# EAGLE design kurodako (EAGLE 7.5.0)
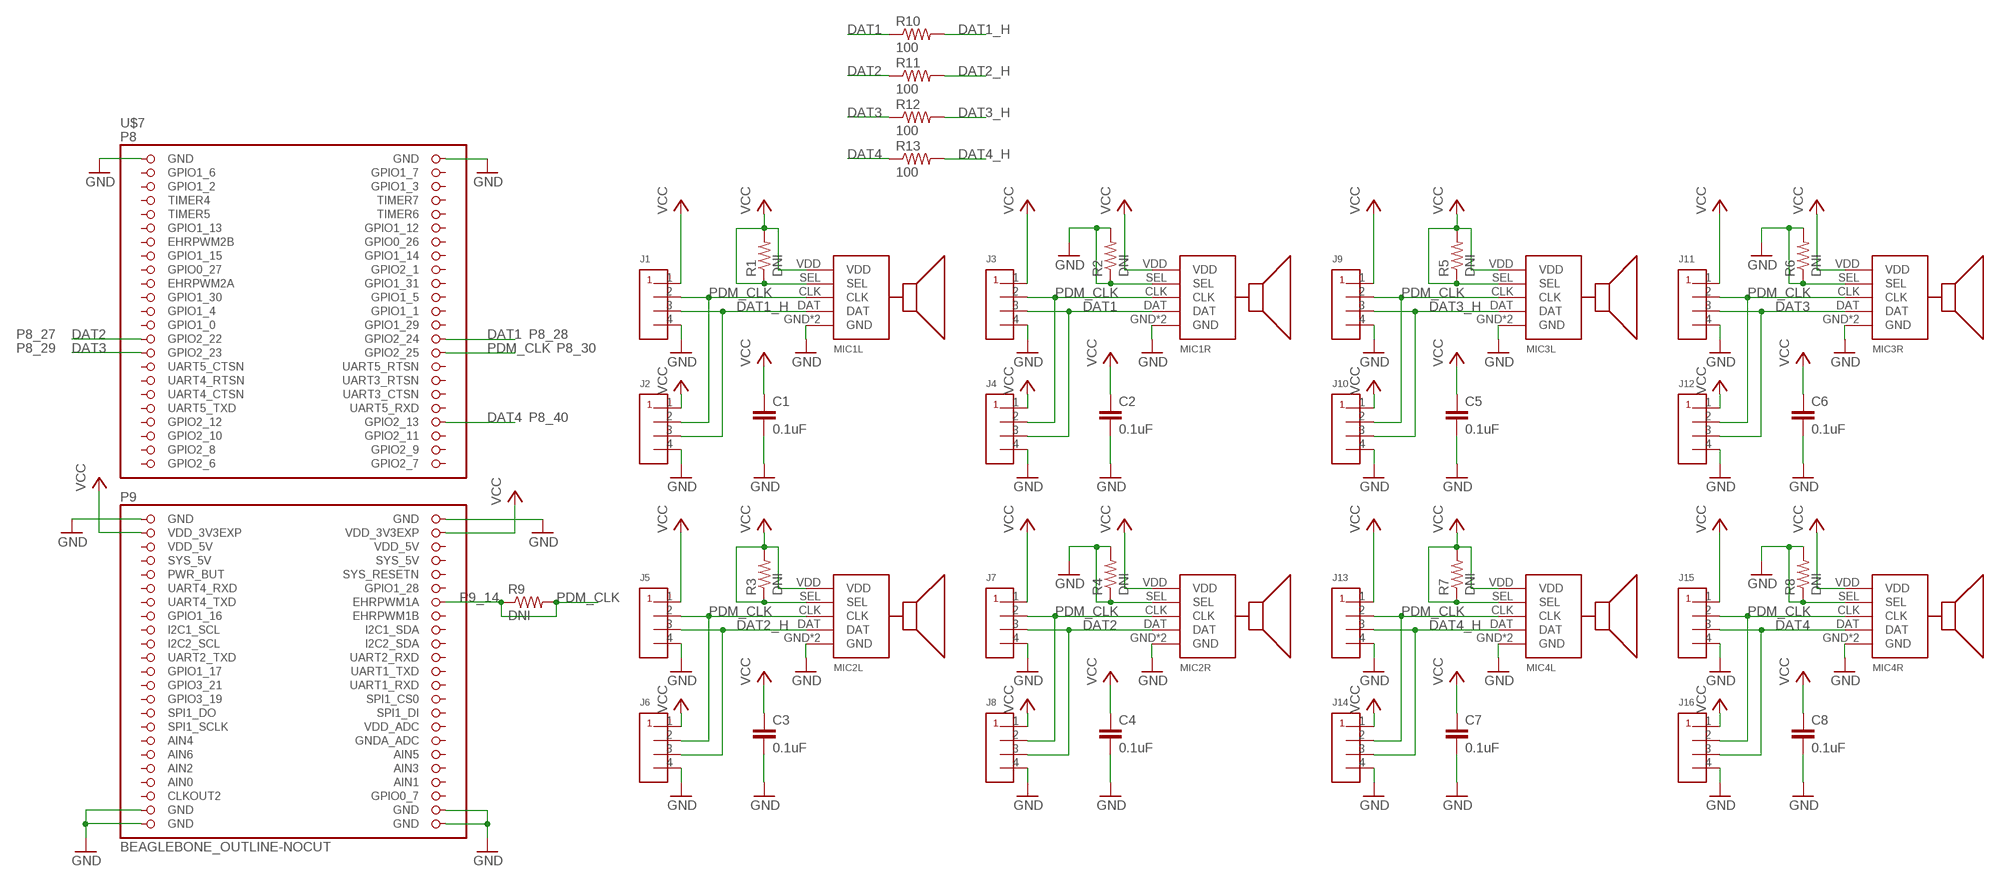
[diagram p0: schematic, sheet 1]

## Parts
C1  0.1uF  CAP0805  [0805]
C2  0.1uF  CAP0805  [0805]
C3  0.1uF  CAP0805  [0805]
C4  0.1uF  CAP0805  [0805]
C5  0.1uF  CAP0805  [0805]
C6  0.1uF  CAP0805  [0805]
C7  0.1uF  CAP0805  [0805]
C8  0.1uF  CAP0805  [0805]
J1  CONN-4P-MICROMATCH-SMD  [MICROMATCH-4P-SMD]
J2  CONN-4P-MICROMATCH-SMD  [MICROMATCH-4P-SMD]
J3  CONN-4P-MICROMATCH-SMD  [MICROMATCH-4P-SMD]
J4  CONN-4P-MICROMATCH-SMD  [MICROMATCH-4P-SMD]
J5  CONN-4P-MICROMATCH-SMD  [MICROMATCH-4P-SMD]
J6  CONN-4P-MICROMATCH-SMD  [MICROMATCH-4P-SMD]
J7  CONN-4P-MICROMATCH-SMD  [MICROMATCH-4P-SMD]
J8  CONN-4P-MICROMATCH-SMD  [MICROMATCH-4P-SMD]
J9  CONN-4P-MICROMATCH-SMD  [MICROMATCH-4P-SMD]
J10  CONN-4P-MICROMATCH-SMD  [MICROMATCH-4P-SMD]
J11  CONN-4P-MICROMATCH-SMD  [MICROMATCH-4P-SMD]
J12  CONN-4P-MICROMATCH-SMD  [MICROMATCH-4P-SMD]
J13  CONN-4P-MICROMATCH-SMD  [MICROMATCH-4P-SMD]
J14  CONN-4P-MICROMATCH-SMD  [MICROMATCH-4P-SMD]
J15  CONN-4P-MICROMATCH-SMD  [MICROMATCH-4P-SMD]
J16  CONN-4P-MICROMATCH-SMD  [MICROMATCH-4P-SMD]
MIC1L  SPM1437HM4H-B  [MEMS-MIC-6PAD]
MIC1R  SPM1437HM4H-B  [MEMS-MIC-6PAD]
MIC2L  SPM1437HM4H-B  [MEMS-MIC-6PAD]
MIC2R  SPM1437HM4H-B  [MEMS-MIC-6PAD]
MIC3L  SPM1437HM4H-B  [MEMS-MIC-6PAD]
MIC3R  SPM1437HM4H-B  [MEMS-MIC-6PAD]
MIC4L  SPM1437HM4H-B  [MEMS-MIC-6PAD]
MIC4R  SPM1437HM4H-B  [MEMS-MIC-6PAD]
R1  DNI  R-US_R0805  [R0805]
R2  DNI  R-US_R0805  [R0805]
R3  DNI  R-US_R0805  [R0805]
R4  DNI  R-US_R0805  [R0805]
R5  DNI  R-US_R0805  [R0805]
R6  DNI  R-US_R0805  [R0805]
R7  DNI  R-US_R0805  [R0805]
R8  DNI  R-US_R0805  [R0805]
R9  DNI  R-US_R0805  [R0805]
R10  100  R-US_R0805  [R0805]
R11  100  R-US_R0805  [R0805]
R12  100  R-US_R0805  [R0805]
R13  100  R-US_R0805  [R0805]
U$7  BEAGLEBONE_OUTLINE-NOCUT  [BEAGLEBONE_SHIELD_NOCUT]

## Nets
DAT1: J3.3 J4.3 MIC1R.DAT R10.1 U$7.28(GPIO2_24)
DAT1_H: J1.3 J2.3 MIC1L.DAT R10.2
DAT2: J7.3 J8.3 MIC2R.DAT R11.1 U$7.27(GPIO2_22)
DAT2_H: J5.3 J6.3 MIC2L.DAT R11.2
DAT3: J11.3 J12.3 MIC3R.DAT R12.1 U$7.29(GPIO2_23)
DAT3_H: J9.3 J10.3 MIC3L.DAT R12.2
DAT4: J15.3 J16.3 MIC4R.DAT R13.1 U$7.40(GPIO2_13)
DAT4_H: J13.3 J14.3 MIC4L.DAT R13.2
GND: C1.2 C2.2 C3.2 C4.2 C5.2 C6.2 C7.2 C8.2 J1.4 J2.4 J3.4 J4.4 J5.4 J6.4 J7.4 J8.4 J9.4 J10.4 J11.4 J12.4 J13.4 J14.4 J15.4 J16.4 MIC1L.GND MIC1L.GND@1(GND) MIC1R.GND MIC1R.GND@1(GND) MIC1R.SEL MIC2L.GND MIC2L.GND@1(GND) MIC2R.GND MIC2R.GND@1(GND) MIC2R.SEL MIC3L.GND MIC3L.GND@1(GND) MIC3R.GND MIC3R.GND@1(GND) MIC3R.SEL MIC4L.GND MIC4L.GND@1(GND) MIC4R.GND MIC4R.GND@1(GND) MIC4R.SEL R2.1 R2.2 R4.1 R4.2 R6.1 R6.2 R8.1 R8.2 U$7.1(GND) U$7.2(GND) U$7.47(GND) U$7.48(GND) U$7.89(GND) U$7.90(GND) U$7.91(GND) U$7.92(GND)
PDM_CLK: J1.2 J2.2 J3.2 J4.2 J5.2 J6.2 J7.2 J8.2 J9.2 J10.2 J11.2 J12.2 J13.2 J14.2 J15.2 J16.2 MIC1L.CLK MIC1R.CLK MIC2L.CLK MIC2R.CLK MIC3L.CLK MIC3R.CLK MIC4L.CLK MIC4R.CLK R9.1 R9.2 U$7.30(GPIO2_25) U$7.60(EHRPWM1A)
VCC: C1.1 C2.1 C3.1 C4.1 C5.1 C6.1 C7.1 C8.1 J1.1 J2.1 J3.1 J4.1 J5.1 J6.1 J7.1 J8.1 J9.1 J10.1 J11.1 J12.1 J13.1 J14.1 J15.1 J16.1 MIC1L.SEL MIC1L.VDD MIC1R.VDD MIC2L.SEL MIC2L.VDD MIC2R.VDD MIC3L.SEL MIC3L.VDD MIC3R.VDD MIC4L.SEL MIC4L.VDD MIC4R.VDD R1.1 R1.2 R3.1 R3.2 R5.1 R5.2 R7.1 R7.2 U$7.49(VDD_3V3EXP) U$7.50(VDD_3V3EXP)
Unconnected: U$7.3(GPIO1_6) U$7.4(GPIO1_7) U$7.5(GPIO1_2) U$7.6(GPIO1_3) U$7.7(TIMER4) U$7.8(TIMER7) U$7.9(TIMER5) U$7.10(TIMER6) U$7.11(GPIO1_13) U$7.12(GPIO1_12) U$7.13(EHRPWM2B) U$7.14(GPIO0_26) U$7.15(GPIO1_15) U$7.16(GPIO1_14) U$7.17(GPIO0_27) U$7.18(GPIO2_1) U$7.19(EHRPWM2A) U$7.20(GPIO1_31) U$7.21(GPIO1_30) U$7.22(GPIO1_5) U$7.23(GPIO1_4) U$7.24(GPIO1_1) U$7.25(GPIO1_0) U$7.26(GPIO1_29) U$7.31(UART5_CTSN) U$7.32(UART5_RTSN) U$7.33(UART4_RTSN) U$7.34(UART3_RTSN) U$7.35(UART4_CTSN) U$7.36(UART3_CTSN) U$7.37(UART5_TXD) U$7.38(UART5_RXD) U$7.39(GPIO2_12) U$7.41(GPIO2_10) U$7.42(GPIO2_11) U$7.43(GPIO2_8) U$7.44(GPIO2_9) U$7.45(GPIO2_6) U$7.46(GPIO2_7) U$7.54(SYS_5V) U$7.55(PWR_BUT) U$7.56(SYS_RESETN) U$7.57(UART4_RXD) U$7.58(GPIO1_28) U$7.59(UART4_TXD) U$7.61(GPIO1_16) U$7.62(EHRPWM1B) U$7.63(I2C1_SCL) U$7.64(I2C1_SDA) U$7.65(I2C2_SCL) U$7.66(I2C2_SDA) U$7.67(UART2_TXD) U$7.68(UART2_RXD) U$7.69(GPIO1_17) U$7.70(UART1_TXD) U$7.71(GPIO3_21) U$7.72(UART1_RXD) U$7.73(GPIO3_19) U$7.74(SPI1_CS0) U$7.75(SPI1_DO) U$7.76(SPI1_DI) U$7.77(SPI1_SCLK) U$7.78(VDD_ADC) U$7.79(AIN4) U$7.80(GNDA_ADC) U$7.81(AIN6) U$7.82(AIN5) U$7.83(AIN2) U$7.84(AIN3) U$7.86(AIN1) U$7.87(CLKOUT2) U$7.88(GPIO0_7)

## Notes on the sheet
- P8_27 | P8_28
- P8_29 | P8_30
- P8_40
- P9_14

## Power pins joined to a net without a drawn wire
AIN0: U$7.85(AIN0)
SYS_5V: U$7.53(SYS_5V)
VDD_5V: U$7.51(VDD_5V) U$7.52(VDD_5V)

## Library data of the parts
C1-C8 = SparkFun:CAP: Capacitor Standard 0603 ceramic capacitor, and 0.1" leaded capacitor.
J1-J16 = LCAV:CONN-4P
MIC1L MIC1R MIC2L MIC2R MIC3L MIC3R MIC4L MIC4R = LCAV:SPM1437HM4H-B
R1-R13 = adafruit:R-US_: RESISTOR, American symbol
U$7 = LCAV:BEAGLEBONE_OUTLINE: Should match A3 pinout - but not completely tested

## Board
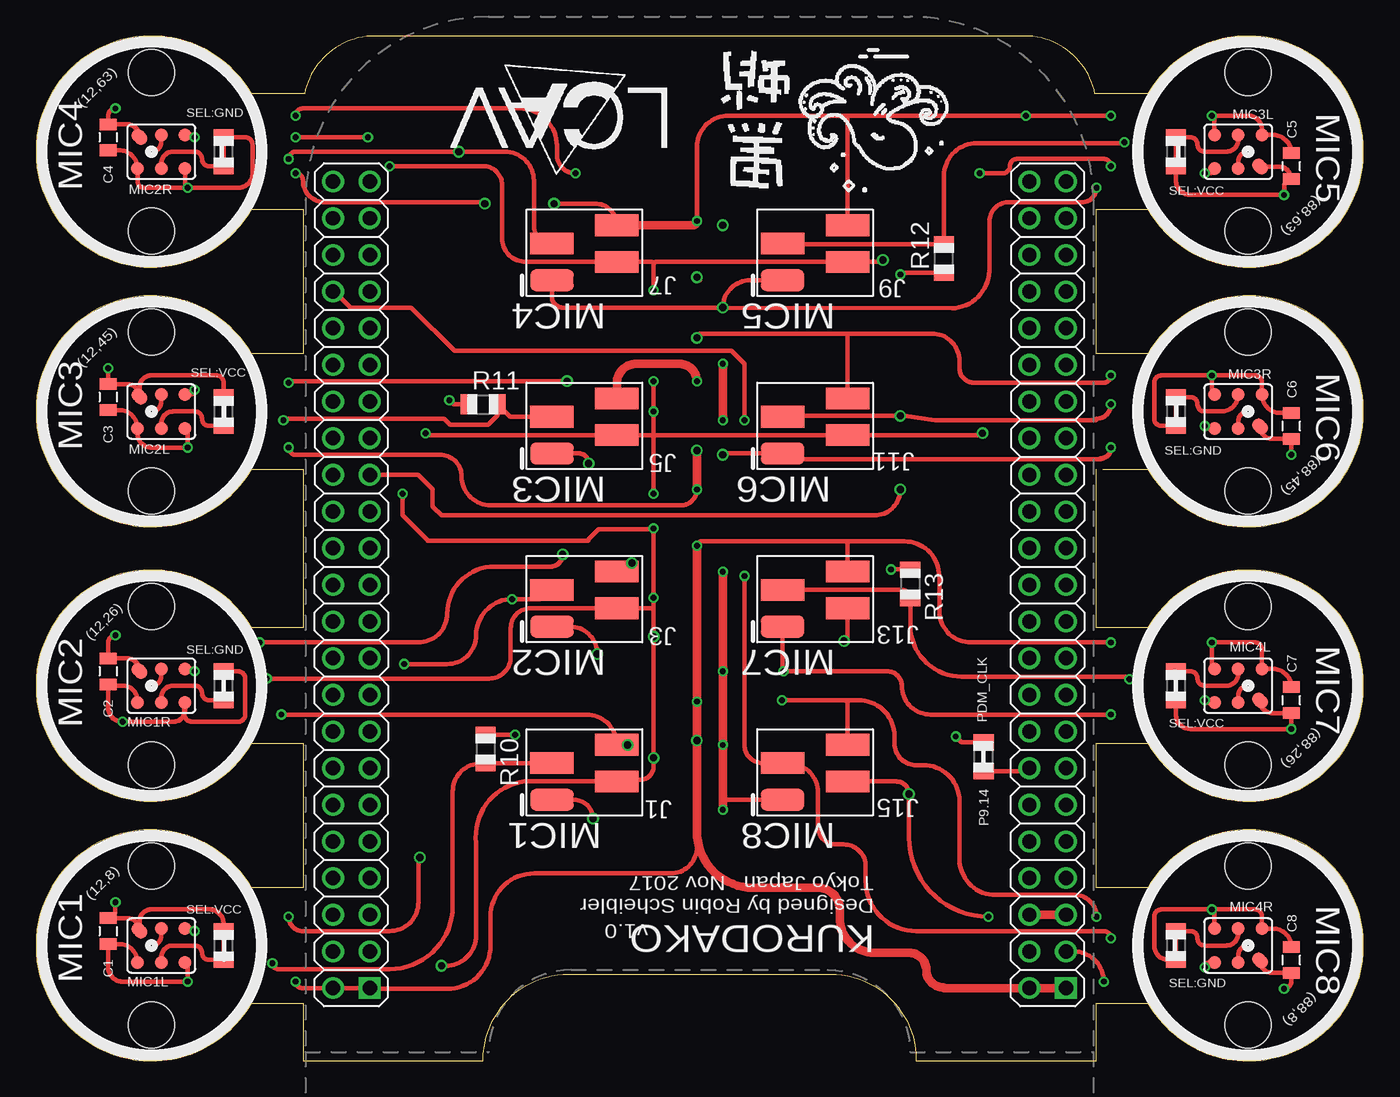
[diagram p1: board, top side]
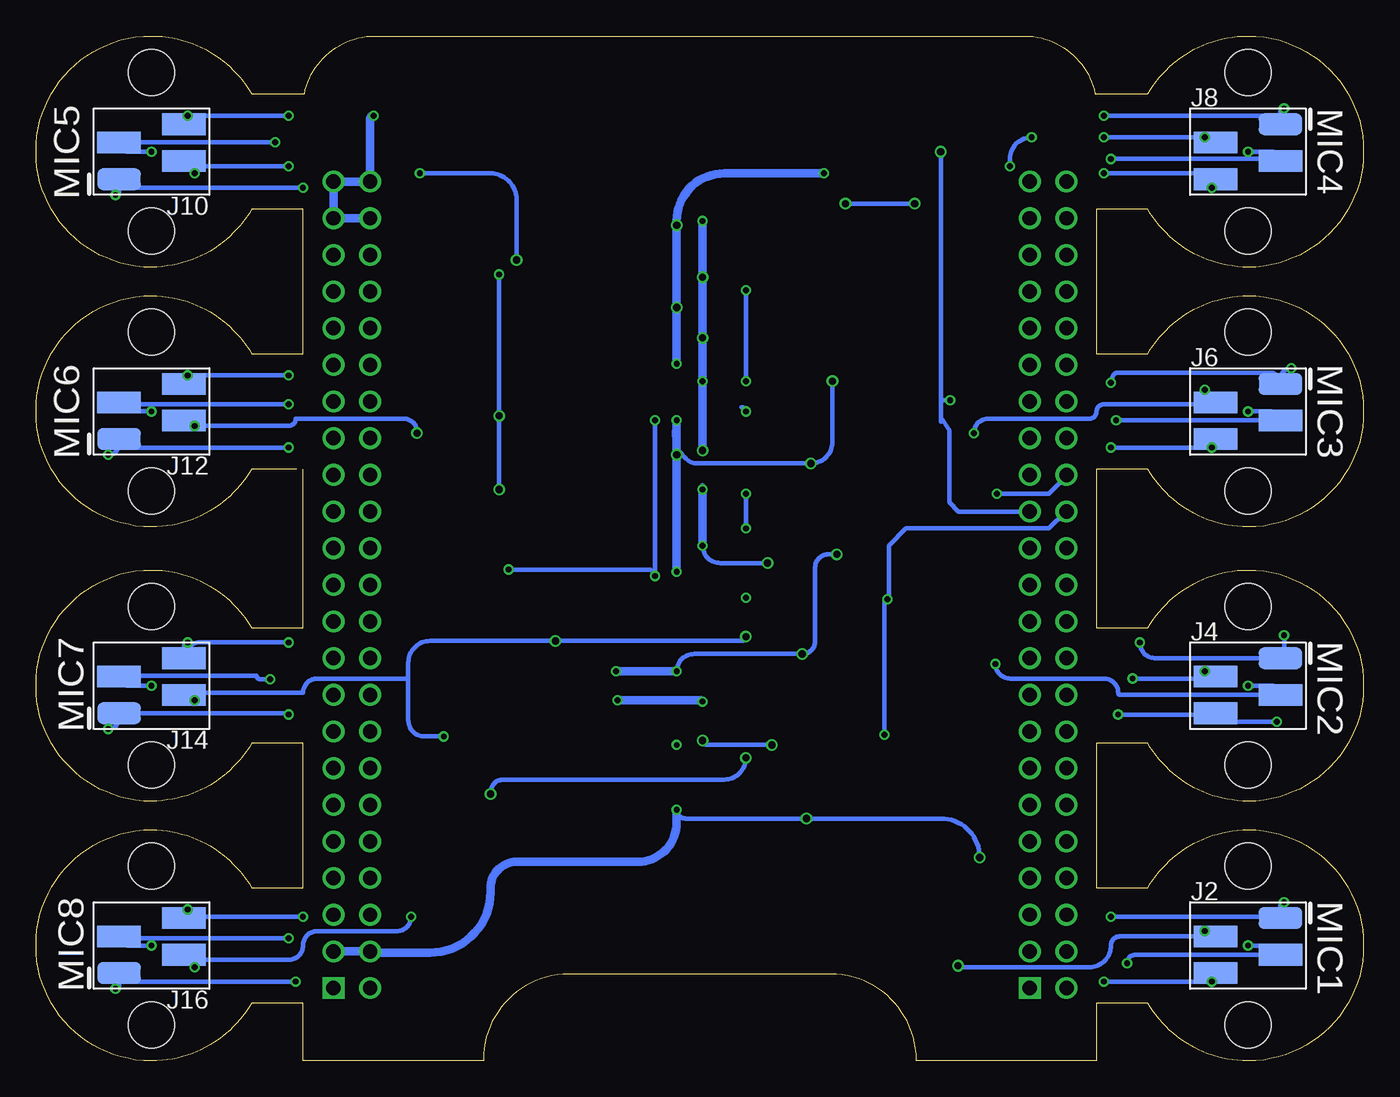
[diagram p2: board, bottom side, seen from below]

Size 92 x 71 mm. Coordinates in mm from the lower left corner, seen from the top.
Outline: 73.95,41 77.07,41 77.25,40.7 77.44,40.41 77.86,39.87 78.08,39.61 78.32,39.37 78.56,39.12 78.82,38.89 79.09,38.68 79.36,38.47 79.65,38.28 79.95,38.1 80.24,37.93 80.55,37.77 80.87,37.63 81.19,37.5 81.52,37.38 81.86,37.29 82.2,37.19 82.55,37.12 82.91,37.07 83.27,37.02 83.63,37 84.55,37 85.09,37.06 85.61,37.16 86.13,37.27 86.64,37.43 87.11,37.63 87.59,37.83 88.05,38.08 88.9,38.65 89.3,38.98 90.02,39.7 90.35,40.1 90.63,40.53 90.92,40.95 91.17,41.41 91.57,42.36 91.73,42.87 91.84,43.39 91.94,43.91 92,44.45 92,45.55 91.94,46.09 91.84,46.61 91.73,47.13 91.57,47.63 91.37,48.11 91.17,48.59 90.92,49.05 90.63,49.47 90.35,49.9 90.02,50.29 89.66,50.66 89.3,51.02 88.9,51.35 88.05,51.92 87.59,52.17 87.11,52.37 86.64,52.57 86.13,52.73 85.61,52.84 85.09,52.94 84.55,53 83.63,53 83.27,52.97 82.55,52.88 82.2,52.8 81.52,52.62 81.19,52.5 80.87,52.36 80.55,52.23 80.24,52.07 79.95,51.9 79.65,51.72 79.36,51.53 79.09,51.32 78.82,51.1 78.56,50.88 78.32,50.63 78.08,50.39 77.86,50.13 77.65,49.86 77.44,49.58 77.25,49.3 77.07,49 73.5,49 73.5,59 77.07,59 77.25,58.7 77.44,58.41 77.86,57.87 78.08,57.61 78.32,57.37 78.56,57.12 78.82,56.89 79.09,56.68 79.36,56.47 79.65,56.28 79.95,56.1 80.24,55.93 80.55,55.77 81.19,55.5 81.52,55.38 82.2,55.19 82.55,55.12 82.91,55.07 83.27,55.03 83.63,55 84.55,55 85.09,55.06 85.61,55.16 86.13,55.27 86.64,55.43 87.11,55.63 87.59,55.83 88.05,56.08 88.47,56.37 88.9,56.65 89.3,56.98 89.66,57.34 90.02,57.71 90.35,58.1 90.92,58.95 91.17,59.41 91.37,59.89 91.57,60.36 91.73,60.87 91.84,61.39 91.94,61.91 92,62.45 92,63.55 91.94,64.09 91.84,64.61 91.73,65.13 91.57,65.64 91.17,66.59 90.92,67.05 90.35,67.9 90.02,68.3 89.66,68.66 89.3,69.02 88.9,69.35 88.47,69.63 88.05,69.92 87.59,70.17 87.11,70.37 86.64,70.57 86.13,70.73 85.61,70.84 85.09,70.94 84.55,71 83.63,71 83.27,70.97 82.55,70.88 82.2,70.81 81.86,70.71 81.52,70.62 81.19,70.5 80.87,70.36 80.55,70.23 80.24,70.07 79.95,69.9 79.65,69.72 79.36,69.53 79.09,69.32 78.82,69.11 78.56,68.88 78.32,68.63 78.08,68.39 77.86,68.13 77.44,67.59 77.25,67.3 77.07,67 73.4,67 73.34,67.29 73.26,67.56 73.15,67.83 73.05,68.09 72.92,68.35 72.63,68.83 72.47,69.06 72.28,69.27 72.1,69.48 71.9,69.68 71.68,69.86 71.47,70.03 71.24,70.2 70.99,70.34 70.75,70.48 70.49,70.6 70.22,70.7 69.95,70.79 69.67,70.87 69.39,70.92 69.1,70.97 68.8,71 23.2,71 22.9,70.97 22.61,70.92 22.33,70.87 22.05,70.79 21.78,70.7 21.51,70.6 21.25,70.48 21.01,70.34 20.76,70.2 20.53,70.03 20.32,69.86 20.1,69.68 19.9,69.48 19.72,69.27 19.53,69.06 19.37,68.83 19.07,68.35 18.95,68.09 18.84,67.83 18.74,67.56 18.66,67.29 18.6,67 14.93,67 14.75,67.3 14.56,67.59 14.35,67.86 14.15,68.13 13.92,68.39 13.68,68.63 13.44,68.88 13.18,69.11 12.91,69.32 12.64,69.53 12.35,69.72 11.76,70.07 11.45,70.23 11.13,70.36 10.81,70.5 10.48,70.62 10.14,70.71 9.8,70.81 9.45,70.88 9.09,70.93 8.73,70.97 8.37,71 7.45,71 6.91,70.94 6.39,70.84 5.87,70.73 5.37,70.57 4.89,70.37 4.41,70.17 3.95,69.92 3.1,69.35 2.71,69.02 2.34,68.66 1.98,68.3 1.65,67.9 1.37,67.47 1.08,67.05 0.83,66.59 0.43,65.64 0.27,65.13 0.16,64.61 0.06,64.09 0,63.55 0,62.45 0.06,61.91 0.16,61.39 0.27,60.87 0.43,60.36 0.63,59.89 0.83,59.41 1.08,58.95 1.37,58.53 1.65,58.1 1.98,57.71 2.34,57.34 2.71,56.98 3.1,56.65 3.95,56.08 4.41,55.83 4.89,55.63 5.37,55.43 5.87,55.27 6.39,55.16 6.91,55.06 7.45,55 8.37,55 8.73,55.03 9.09,55.07 9.45,55.12 9.8,55.19 10.14,55.29 10.48,55.38 10.81,55.5 11.13,55.64 11.45,55.77 11.76,55.93 12.35,56.28 12.64,56.47 12.91,56.68 13.18,56.89 13.44,57.12 13.68,57.37 13.92,57.61 14.15,57.87 14.35,58.14 14.56,58.41 14.75,58.7 14.93,59 18.5,59 18.5,49 14.93,49 14.75,49.3 14.56,49.58 14.35,49.86 14.15,50.13 13.92,50.39 13.68,50.63 13.44,50.88 13.18,51.1 12.91,51.32 12.64,51.53 12.35,51.72 11.76,52.07 11.45,52.23 11.13,52.36 10.81,52.5 10.48,52.62 10.14,52.71 9.8,52.8 9.45,52.88 9.09,52.93 8.73,52.97 8.37,53 7.45,53 6.91,52.94 6.39,52.84 5.87,52.73 5.37,52.57 4.89,52.37 4.41,52.17 3.95,51.92 3.53,51.63 3.1,51.35 2.71,51.02 2.34,50.66 1.98,50.29 1.65,49.9 1.37,49.47 1.08,49.05 0.83,48.59 0.43,47.63 0.27,47.13 0.16,46.61 0.06,46.09 0,45.55 0,44.45 0.06,43.91 0.16,43.39 0.27,42.87 0.43,42.36 0.63,41.89 0.83,41.41 1.08,40.95 1.37,40.53 1.65,40.1 1.98,39.7 2.71,38.98 3.1,38.65 3.53,38.37 3.95,38.08 4.41,37.83 4.89,37.63 5.37,37.43 5.87,37.27 6.39,37.16 6.91,37.06 7.45,37 8.37,37 8.73,37.02 9.09,37.07 9.45,37.12 9.8,37.19 10.14,37.29 10.48,37.38 10.81,37.5 11.13,37.63 11.45,37.77 11.76,37.93 12.35,38.28 12.64,38.47 12.91,38.68 13.18,38.89 13.44,39.12 13.68,39.37 13.92,39.61 14.15,39.87 14.56,40.41 14.75,40.7 14.93,41 18.5,41 18.5,30 14.93,30 14.75,30.3 14.56,30.58 14.35,30.86 14.15,31.13 13.92,31.39 13.68,31.63 13.44,31.88 13.18,32.1 12.91,32.32 12.64,32.53 12.35,32.72 11.76,33.07 11.45,33.23 11.13,33.36 10.81,33.5 10.48,33.62 9.8,33.8 9.45,33.88 9.09,33.93 8.73,33.97 8.37,34 7.45,34 6.91,33.94 6.39,33.84 5.87,33.73 5.37,33.57 4.89,33.37 4.41,33.17 3.95,32.92 3.53,32.63 3.1,32.35 2.71,32.02 2.34,31.66 1.98,31.29 1.65,30.9 1.37,30.47 1.08,30.05 0.83,29.59 0.63,29.11 0.43,28.63 0.27,28.13 0.16,27.61 0.06,27.09 0,26.55 0,25.45 0.06,24.91 0.16,24.39 0.27,23.87 0.43,23.36 0.83,22.41 1.08,21.95 1.37,21.53 1.65,21.1 1.98,20.7 2.34,20.34 2.71,19.98 3.1,19.65 3.95,19.08 4.41,18.83 4.89,18.63 5.37,18.43 5.87,18.27 6.91,18.06 7.45,18 8.37,18 8.73,18.02 9.09,18.07 9.45,18.12 9.8,18.19 10.14,18.29 10.48,18.38 10.81,18.5 11.13,18.63 11.45,18.77 11.76,18.93 12.35,19.28 12.64,19.47 12.91,19.68 13.18,19.89 13.44,20.12 13.68,20.37 13.92,20.61 14.15,20.87 14.56,21.41 14.75,21.7 14.93,22 18.5,22 18.5,12 14.93,12 14.75,12.3 14.56,12.59 14.15,13.13 13.92,13.39 13.68,13.63 13.44,13.88 13.18,14.11 12.91,14.32 12.64,14.53 12.35,14.72 11.76,15.07 11.45,15.23 11.13,15.36 10.81,15.5 10.48,15.62 10.14,15.71 9.8,15.81 9.45,15.88 9.09,15.93 8.73,15.97 8.37,16 7.45,16 6.91,15.94 6.39,15.84 5.87,15.73 5.37,15.57 4.89,15.37 4.41,15.17 3.95,14.92 3.53,14.63 3.1,14.35 2.71,14.02 2.34,13.66 1.98,13.3 1.65,12.9 1.37,12.47 1.08,12.05 0.83,11.59 0.63,11.11 0.43,10.64 0.27,10.13 0.16,9.61 0.06,9.09 0,8.55 0,7.45 0.06,6.91 0.16,6.39 0.27,5.87 0.43,5.36 0.83,4.41 1.08,3.95 1.37,3.53 1.65,3.1 1.98,2.71 2.34,2.34 2.71,1.98 3.1,1.65 3.95,1.08 4.41,0.83 4.89,0.63 5.37,0.43 5.87,0.27 6.39,0.16 6.91,0.06 7.45,0 8.37,0 8.73,0.03 9.09,0.07 9.45,0.12 9.8,0.19 10.14,0.29 10.48,0.38 10.81,0.5 11.13,0.64 11.45,0.77 11.76,0.93 12.35,1.28 12.64,1.47 12.91,1.68 13.18,1.89 13.44,2.12 13.68,2.37 13.92,2.61 14.15,2.87 14.56,3.41 14.75,3.7 14.93,4 18.5,4 18.5,0 31,0 31,0.47 31.04,0.87 31.12,1.26 31.2,1.64 31.32,2.02 31.47,2.37 31.62,2.73 31.8,3.07 32.01,3.38 32.23,3.7 32.47,3.99 32.74,4.26 33.01,4.53 33.3,4.77 33.62,4.99 33.93,5.2 34.27,5.38 34.63,5.53 34.98,5.68 35.36,5.8 35.74,5.88 36.13,5.96 36.53,6 55.47,6 55.87,5.96 56.26,5.88 56.64,5.8 57.02,5.68 57.37,5.53 57.73,5.38 58.06,5.2 58.38,4.99 58.7,4.77 58.99,4.53 59.53,3.99 59.77,3.7 59.99,3.38 60.2,3.07 60.38,2.73 60.53,2.37 60.68,2.02 60.8,1.64 60.88,1.26 60.96,0.87 61,0.47 61,0 73.5,0 73.5,4 77.07,4 77.25,3.7 77.44,3.41 77.86,2.87 78.08,2.61 78.32,2.37 78.56,2.12 78.82,1.89 79.09,1.68 79.36,1.47 79.65,1.28 79.95,1.1 80.24,0.93 80.55,0.77 80.87,0.64 81.19,0.5 81.52,0.38 81.86,0.29 82.2,0.19 82.55,0.12 83.27,0.03 83.63,0 84.55,0 85.09,0.06 85.61,0.16 86.13,0.27 86.64,0.43 87.11,0.63 87.59,0.83 88.05,1.08 88.47,1.37 88.9,1.65 89.3,1.98 89.66,2.34 90.02,2.71 90.35,3.1 90.92,3.95 91.17,4.41 91.57,5.36 91.73,5.87 91.84,6.39 91.94,6.91 92,7.45 92,8.55 91.94,9.09 91.84,9.61 91.73,10.13 91.57,10.64 91.37,11.11 91.17,11.59 90.92,12.05 90.63,12.47 90.35,12.9 90.02,13.3 89.3,14.02 88.9,14.35 88.05,14.92 87.59,15.17 87.11,15.37 86.64,15.57 86.13,15.73 85.61,15.84 85.09,15.94 84.55,16 83.63,16 83.27,15.97 82.91,15.93 82.55,15.88 82.2,15.81 81.86,15.71 81.52,15.62 81.19,15.5 80.87,15.36 80.55,15.23 80.24,15.07 79.95,14.9 79.65,14.72 79.36,14.53 79.09,14.32 78.82,14.11 78.56,13.88 78.32,13.63 78.08,13.39 77.86,13.13 77.44,12.59 77.25,12.3 77.07,12 73.5,12 73.5,22 77.07,22 77.25,21.7 77.44,21.41 77.86,20.87 78.08,20.61 78.32,20.37 78.56,20.12 78.82,19.89 79.09,19.68 79.36,19.47 79.65,19.28 79.95,19.1 80.24,18.93 80.55,18.77 80.87,18.63 81.19,18.5 81.52,18.38 81.86,18.29 82.2,18.19 82.55,18.12 82.91,18.07 83.27,18.02 83.63,18 84.55,18 85.09,18.06 85.61,18.16 86.13,18.27 86.64,18.43 87.11,18.63 87.59,18.83 88.05,19.08 88.47,19.37 88.9,19.65 89.3,19.98 90.02,20.7 90.35,21.1 90.63,21.53 90.92,21.95 91.17,22.41 91.37,22.89 91.57,23.36 91.73,23.87 91.84,24.39 91.94,24.91 92,25.45 92,26.55 91.94,27.09 91.84,27.61 91.73,28.13 91.57,28.63 91.17,29.59 90.92,30.05 90.35,30.9 90.02,31.29 89.3,32.02 88.9,32.35 88.05,32.92 87.59,33.17 87.11,33.37 86.64,33.57 86.13,33.73 85.61,33.84 85.09,33.94 84.55,34 83.63,34 83.27,33.97 82.55,33.88 82.2,33.8 81.52,33.62 81.19,33.5 80.87,33.36 80.55,33.23 80.24,33.07 79.95,32.9 79.65,32.72 79.36,32.53 79.09,32.32 78.82,32.1 78.56,31.88 78.32,31.63 78.08,31.39 77.86,31.13 77.65,30.86 77.44,30.58 77.25,30.3 77.07,30 73.5,30 73.5,41
Copper layers (1*16): Top 0.035mm / dielectric 1.5mm / Bottom 0.035mm
Design rules "SeeedStudio_2layer_DRU_no_angle_20140221": minimum track width 6mil, minimum drill 12mil, track to track 6mil, track to pad 6mil, pad to pad 6mil, via to via 6mil, smd to smd 0mil, copper to edge 10mil, drill to drill 10mil, minimum pad ring 10mil, minimum via ring 6mil, stop-mask expansion 2mil, vias tented up to drill 100mil, thermal gap 10mil
Holes 3.2 mm at 8,68.49 8,57.49 8,50.49 8,39.49 8,31.49 8,20.49 8,13.49 8,2.49 84,2.49 84,13.49 84,20.49 84,31.49 84,39.49 84,50.49 84,57.49 84,68.49

### Footprints (pad centres in the part's own frame; a part is rotated, then mirrored left to right if it is on the bottom)
0805 = smd 0.8 x 1.2: 1 -0.9,0; 2 0.9,0
MICROMATCH-4P-SMD = smd 1.5 x 3: 1 -1.905,2.25; 2 -0.635,-2.25; 3 0.635,2.25; 4 1.905,-2.25
MEMS-MIC-6PAD = smd 0.91 x 0.91: CLK 1.17,-2.33; DAT 1.17,-0.68; GND -1.17,0.97; GND@1 -1.17,-2.33; SEL -1.17,-0.68 | smd 0.91 x 1.19 rotated 135: VDD 1.03,0.83
R0805 = smd 1.1 x 1.4: 1 -1,0; 2 1,0
BEAGLEBONE_SHIELD_NOCUT = drill 1 square: 1 4.445,19.05; 47 52.705,19.05 | drill 1: 2 1.905,19.05; 3 4.445,21.59; 4 1.905,21.59; 5 4.445,24.13; 6 1.905,24.13; 7 4.445,26.67; 8 1.905,26.67; 9 4.445,29.21; 10 1.905,29.21; 11 4.445,31.75; 12 1.905,31.75; 13 4.445,34.29; 14 1.905,34.29; 15 4.445,36.83; 16 1.905,36.83; 17 4.445,39.37; 18 1.905,39.37; 19 4.445,41.91; 20 1.905,41.91; 21 4.445,44.45; 22 1.905,44.45; 23 4.445,46.99; 24 1.905,46.99; 25 4.445,49.53; 26 1.905,49.53; 27 4.445,52.07; 28 1.905,52.07; 29 4.445,54.61; 30 1.905,54.61; 31 4.445,57.15; 32 1.905,57.15; 33 4.445,59.69; 34 1.905,59.69; 35 4.445,62.23; 36 1.905,62.23; 37 4.445,64.77; 38 1.905,64.77; 39 4.445,67.31; 40 1.905,67.31; 41 4.445,69.85; 42 1.905,69.85; 43 4.445,72.39; 44 1.905,72.39; 45 4.445,74.93; 46 1.905,74.93; 48 50.165,19.05; 49 52.705,21.59; 50 50.165,21.59; 51 52.705,24.13; 52 50.165,24.13; 53 52.705,26.67; 54 50.165,26.67; 55 52.705,29.21; 56 50.165,29.21; 57 52.705,31.75; 58 50.165,31.75; 59 52.705,34.29; 60 50.165,34.29; 61 52.705,36.83; 62 50.165,36.83; 63 52.705,39.37; 64 50.165,39.37; 65 52.705,41.91; 66 50.165,41.91; 67 52.705,44.45; 68 50.165,44.45; 69 52.705,46.99; 70 50.165,46.99; 71 52.705,49.53; 72 50.165,49.53; 73 52.705,52.07; 74 50.165,52.07; 75 52.705,54.61; 76 50.165,54.61; 77 52.705,57.15; 78 50.165,57.15; 79 52.705,59.69; 80 50.165,59.69; 81 52.705,62.23; 82 50.165,62.23; 83 52.705,64.77; 84 50.165,64.77; 85 52.705,67.31; 86 50.165,67.31; 87 52.705,69.85; 88 50.165,69.85; 89 52.705,72.39; 90 50.165,72.39; 91 52.705,74.93; 92 50.165,74.93

### Placement (x,y rotation side)
C1  5,8.99 270 top
C2  5,26.99 270 top
C3  5,45.99 270 top
C4  5,63.99 270 top
C5  87,61.99 90 top
C6  87,43.99 90 top
C7  87,24.99 90 top
C8  87,6.99 90 top
J1  38,19.99 90 top
J2  8,7.99 270 bottom
J3  38,31.99 90 top
J4  8,25.99 270 bottom
J5  38,43.99 90 top
J6  8,44.99 270 bottom
J7  38,55.99 90 top
J8  8,62.99 270 bottom
J9  54,55.99 90 top
J10  84,62.99 90 bottom
J11  54,43.99 90 top
J12  84,44.99 90 bottom
J13  54,31.99 90 top
J14  84,25.99 90 bottom
J15  54,19.99 90 top
J16  84,7.99 90 bottom
MIC1L  8,7.99 90 top
MIC1R  8,25.99 90 top
MIC2L  8,44.99 90 top
MIC2R  8,62.99 90 top
MIC3L  84,62.99 270 top
MIC3R  84,44.99 270 top
MIC4L  84,25.99 270 top
MIC4R  84,7.99 270 top
R1  13,7.99 90 top
R2  13,25.99 90 top
R3  13,44.99 90 top
R4  13,62.99 90 top
R5  79,62.99 270 top
R6  79,44.99 270 top
R7  79,25.99 270 top
R8  79,7.99 270 top
R9  65.67,21.07 90 top
R10  31.16,21.6 270 top
R11  30.98,45.48 0 top
R12  62.93,55.59 90 top
R13  60.59,33.04 270 top
U$1  [LCAV_LOGO_15MM]  43.7,68.99 180 top
U$7  18.68,-14.01 0 top

### Tracks (layer width: path | path; a pad name or v marks a point on that pad's centre or on a via)
DAT1  (via drill 0.4)
  Top 0.3: MIC1R.DAT 8.68,26.67 arc-90 v8,25.99 | v25.5,27.49 28.5,27.49 arc90 30.5,29.49 arc-90 v33,31.99 34.9,31.99 arc90 35,32.09 35.75,32.09 J3.3 | R10.1 arc90 R10.1 v33.2,22.59
  Bottom 0.3: v8,25.99 6.39,25.99 arc90 J4.3 16.87,25.35 arc90 17,25.49 arc-90 18,26.49 24.5,26.49 arc90 v25.5,27.49 | U$7.28 20.63,38.06 21.8,36.89 31.7,36.89 32.9,35.69 32.9,32.09 v33,31.99 33.2,31.79 v33.2,22.59
DAT1_H  (via drill 0.4)
  Top 0.3: MIC1L.DAT 8.68,8.67 arc-90 v8,7.99 | J1.3 31.18,20.62 R10.2 30.8,20.6 arc90 28.88,18.68 28.88,10.74 arc-90 24.5,6.36 16.79,6.36 arc-90 v16.38,6.76
  Bottom 0.3: v8,7.99 6.39,7.99 arc90 J2.3 15.79,7.35 arc-90 v16.38,6.76
DAT2  (via drill 0.4, 0.5)
  Top 0.3: MIC2R.DAT 8.68,63.67 arc-90 v8,62.99 | v17.5,62.49 arc-90 18,62.99 v29.3,62.99 32.5,62.99 arc-90 34.5,60.99 34.5,57.87 arc90 J7.3 | R11.1 28.94,45.48 v28.65,45.78
  Bottom 0.3: v8,62.99 6.39,62.99 arc90 J8.3 arc-90 5.89,62.49 v17.5,62.49 | U$7.27 28.07,38.06 28.7,38.69 28.7,43.69 29.3,44.59 | v29.3,62.99 29.3,45.78 | 29.3,45.78 29.3,44.59 | 29.3,44.29 29.3,44.59 | v28.65,45.78 29.3,45.78
DAT2_H  (via drill 0.4)
  Top 0.3: MIC2L.DAT 8.68,45.67 arc-90 v8,44.99 | J5.3 32.84,44.62 R11.2 31.98,44.73 31.33,44.08 28.7,44.08 28.3,44.49 17.26,44.49 v17.14,44.37
  Bottom 0.3: v8,44.99 6.39,44.99 arc90 J6.3 5.77,44.37 v17.14,44.37
DAT3  (via drill 0.4, 0.5)
  Top 0.3: MIC3R.DAT 83.32,44.31 arc-90 v84,44.99 | v74.5,45.49 arc-90 73.5,44.49 arc-90 73.4,44.39 62.3,44.39 60.2,44.69 v59.9,44.69 51.82,44.69 arc90 J11.3 | U$7.29 26.49,40.6 27.5,39.59 27.5,38.39 28.1,37.79 58.1,37.79 arc90 v59.9,39.59 | R12.1 60.01,54.59 arc90 v59.9,54.48
  Bottom 0.3: v84,44.99 85.62,44.99 arc90 J12.3 arc-90 86.12,45.49 v74.5,45.49 | v59.9,54.48 v59.9,44.69 v59.9,39.59
DAT3_H  (via drill 0.4)
  Top 0.3: MIC3L.DAT 83.32,62.31 arc-90 v84,62.99 | J9.3 arc90 51.79,56.59 R12.2 62.93,61.31 arc-90 65.2,63.59 75.37,63.59 arc90 v75.42,63.65
  Bottom 0.3: v84,62.99 85.62,62.99 arc90 J10.3 arc90 86.23,63.65 v75.42,63.65
DAT4  (via drill 0.4)
  Top 0.3: MIC4R.DAT 83.32,7.31 arc-90 v84,7.99 | v74.5,8.49 arc90 74,8.99 61,8.99 arc-90 57.5,12.49 57.5,13.49 arc90 56,14.99 55.4,14.99 arc-90 54.2,16.19 54.2,18.59 arc90 52.17,20.62 J15.3 50.37,20.62 arc-90 49.1,21.89 v49.1,33.59 | U$7.40 20.69,53.3 21.8,52.19 26,52.19 29,49.19 48.2,49.19 49.1,48.29 v49.1,44.39 | R13.1 v59.25,34.04 arc90 v59.25,34.04
  Bottom 0.3: v84,7.99 85.62,7.99 arc90 J16.3 arc-90 86.12,8.49 v74.5,8.49 | v49.1,44.39 v49.1,33.59 arc-90 49.55,34.04 v59.25,34.04
DAT4_H  (via drill 0.4)
  Top 0.3: MIC4L.DAT 83.32,25.31 arc-90 v84,25.99 | J13.3 60.01,32.62 arc-90 R13.2 60.59,30.18 arc90 64.15,26.62 75.6,26.62 arc-90 v75.77,26.44
  Bottom 0.3: v84,25.99 85.62,25.99 arc90 J14.3 | 86.12,26.49 arc90 J14.3 | v75.77,26.44 76.48,26.44 arc90 76.71,26.68 86.2,26.68 arc-90 J14.3
GND  (via drill 0.4, 0.5)
  Top 0.3: MIC1R.GND 7.03,24.96 arc90 6,25.99 5.1,25.99 arc-90 C2.2 5,24.49 arc90 v6,23.49 9.5,23.49 arc90 10.33,24.32 MIC1R.GND@1 arc90 10.25,24.74 J4.4 arc90 10.85,23.49 14,23.49 arc90 14.5,23.99 14.5,26.49 arc90 14,26.99 R2.2 R2.1 12,24.99 arc-90 11.5,25.49 arc90 11,25.99 9.5,25.99 arc90 8.68,25.17 MIC1R.SEL | C1.2 5.1,8.09 | MIC1L.GND arc90 5.76,8.09 5.1,8.09 | MIC1L.GND@1 arc-90 10.5,6.65 v10.5,5.49 6,5.49 arc-90 5,6.49 5,7.99 arc-90 5.1,8.09 | C3.2 5.76,45.09 arc-90 MIC2L.GND 7.03,43.46 arc90 8,42.49 v10.5,42.49 10.5,43.65 arc90 MIC2L.GND@1 | MIC2R.SEL 8.68,62.17 arc-90 9.5,62.99 11,62.99 arc-90 11.5,62.49 arc90 12,61.99 R4.1 R4.2 14.5,63.99 arc-90 15,63.49 15,61.49 arc-90 14,60.49 v10.5,60.49 | C4.2 5.76,63.09 arc-90 MIC2R.GND 7.03,60.96 arc90 7.5,60.49 v10.5,60.49 | 10.33,60.66 arc90 v10.5,60.49 | MIC2R.GND@1 10.33,60.66 | 10.33,60.66 arc90 v10.5,60.49 | C8.2 arc90 85.73,9.16 MIC4R.GND 84.97,10.02 arc90 84.5,10.49 v81.5,10.49 | MIC4R.SEL 83.32,8.81 arc-90 82.5,7.99 81,7.99 arc-90 80.5,8.49 arc90 80,8.99 R8.1 R8.2 78.5,6.99 arc-90 77.5,7.99 77.5,9.99 arc-90 78,10.49 v81.5,10.49 | MIC4R.GND@1 81.67,10.32 arc90 v81.5,10.49 | C7.2 arc90 85.73,27.16 MIC4L.GND 84.97,28.52 arc90 84.5,28.99 v81.5,28.99 81.5,27.33 arc90 MIC4L.GND@1 | C6.2 86.24,44.89 arc-90 MIC3R.GND 84.97,47.02 arc90 84.5,47.49 v81.5,47.49 | MIC3R.SEL arc-90 82.15,44.99 81,44.99 arc-90 80.5,45.49 arc90 80,45.99 R6.1 R6.2 78,43.99 arc-90 77.5,44.49 77.5,46.99 arc-90 78,47.49 v81.5,47.49 | C5.2 arc90 85.73,64.16 MIC3L.GND 84.97,64.52 arc90 84,65.49 v81.5,65.49 arc-90 81.67,65.32 MIC3L.GND@1
  Top 0.3: v18,5.49 arc90 18.45,5.04 U$7.2 U$7.1 arc90 23.18,4.99 28.5,4.99 arc90 31.5,7.99 31.5,9.99 arc-90 34.5,12.99 44,12.99 arc90 45.8,14.79 45.8,15.89 | v17.5,42.49 arc90 18,41.99 28,41.99 arc-90 29.5,40.49 arc90 31.5,38.49 44.7,38.49 arc90 v45.8,39.59 | v18,61.49 arc-90 18.5,60.99 arc90 20,59.49 31,59.49 arc-90 v31.1,59.39 | 56.3,65.49 48,65.49 arc90 45.8,63.29 v45.8,58.19 | 56.3,65.49 v68.6,65.49 v74.5,65.49 | 56.3,50.39 46.1,50.39 arc90 v45.8,50.09 | 56.3,50.39 62.1,50.39 arc-90 64,48.49 64,47.99 arc90 65,46.99 74,46.99 arc90 v74.5,47.49 | v81.5,47.49 81.5,46.33 arc90 MIC3R.GND@1 | v74.5,28.99 64.8,28.99 arc-90 62.6,31.19 62.6,33.59 arc90 60.2,35.99 56.3,35.99 | v51.7,24.99 56,24.99 | 56,24.99 57,24.99 arc-90 59.5,22.49 59.5,21.99 arc90 61,20.49 61.5,20.49 arc-90 64,17.99 64,13.99 arc90 66.5,11.49 72,11.49 arc-90 v73.5,9.99 | 45.8,17.39 arc-90 45.8,17.39 | v35.9,59.39 38.76,59.39 arc-90 J7.4 | v41,21.89 arc90 v41,21.89 J1.4 arc90 38.16,23.99 v17,23.99 | J3.4 40.71,33.89 arc90 v41.3,34.49 | 56.3,35.99 46.1,35.99 arc90 v45.8,35.69 | 46.01,54.08 arc-90 v45.8,54.29 | J9.4 56.25,65.44 arc-90 56.3,65.49 | J11.4 56.25,50.34 arc-90 56.3,50.39 | J13.4 56.25,35.94 arc-90 56.3,35.99 | J15.4 56.25,24.74 arc90 56,24.99
  Top 0.6: 51.8,11.99 54.2,11.99 arc-90 55.7,10.49 55.7,9.89 arc90 58.1,7.49 60.5,7.49 arc-90 61.7,6.29 arc90 62.9,5.09 arc90 62.95,5.04 U$7.48 U$7.47 | 51.8,11.99 49.7,11.99 arc-90 45.8,15.89 45.8,17.39 v45.8,22.19 v45.8,24.89 v45.8,35.69 | v45.8,39.59 v45.8,42.29 | J7.4 45.51,57.89 arc90 v45.8,58.19 | J5.4 40.25,46.94 arc-90 41.6,48.29 44.6,48.29 arc-90 v45.8,47.09 | 51.75,12.04 arc90 51.8,11.99 | 51.75,25.04 arc-90 v51.7,24.99
  Bottom 0.3: v6,23.49 9.66,23.49 arc90 J4.4 | 10.35,23.99 arc-90 J4.4 | v10.5,5.49 arc-90 10.25,5.74 J2.4 arc90 10.85,5.49 v18,5.49 | v10.5,42.49 arc-90 10.25,42.74 J6.4 arc90 10.85,42.49 v17.5,42.49 | v10.5,60.49 10.5,60.83 arc90 J8.4 arc90 10.35,60.99 10.5,60.99 10.5,61.49 v18,61.49 | v81.5,10.49 81.5,10.14 arc90 J16.4 arc90 81.66,9.99 v73.5,9.99 | v81.5,28.99 arc-90 81.75,28.74 J14.4 arc90 80.66,28.99 v74.5,28.99 | J12.4 arc-90 81.5,47.14 v81.5,47.49 arc-90 81.75,47.24 J12.4 | v81.5,65.49 81.5,65.14 arc90 J10.4 arc90 81.66,64.99 81.5,64.99 arc90 81,65.49 v74.5,65.49 | v74.5,47.49 81,47.49 arc-90 81.5,46.99 81.66,46.99 arc-90 J12.4 | v17,23.99 10.35,23.99 | 10.35,23.99 arc-90 J4.4 | 45.9,24.99 arc90 v45.8,24.89 | v45.8,39.59 45.8,39.89 | v31.1,59.39 v35.9,59.39 | v41,21.89 45.5,21.89 arc90 v45.8,22.19 | v41.3,34.49 44.6,34.49 arc90 v45.8,35.69
  Bottom 0.6: v45.8,35.69 v45.8,39.59 | v45.8,42.29 v45.8,47.09 v45.8,50.09 v45.8,54.29 v45.8,58.19 | v68.6,65.49 arc-90 68.85,65.24 U$7.92 U$7.91 U$7.89 U$7.90 | v51.7,24.99 45.9,24.99
PDM_CLK  (via drill 0.4, 0.5)
  Top 0.3: MIC1R.CLK 10.83,27.16 arc-90 v11,26.99 | v16,26.49 31.4,26.49 arc90 32.9,27.99 32.9,29.99 arc-90 34.27,31.35 J3.2 42.67,31.35 arc90 42.8,31.49 | MIC1L.CLK 10.83,9.16 arc-90 v11,8.99 | MIC2R.CLK 10.83,64.16 arc-90 v11,63.99 | MIC4L.CLK 81.17,24.82 arc-90 v81,24.99 | MIC3R.CLK 81.17,43.82 arc-90 v81,43.99 | v24.5,61.99 31,61.99 arc-90 32.3,60.69 32.3,56.99 arc90 33.94,55.35 J7.2 42.64,55.35 arc-90 42.8,55.19 | v23,63.99 v18,63.99 | v65.39,61.49 67,61.49 arc90 67.5,61.99 arc-90 68,62.49 74,62.49 arc-90 v74.5,61.99 | v81,61.49 81.34,61.49 arc90 MIC3L.CLK | v66,9.99 arc-90 60.5,15.49 v60.5,18.49 arc90 59.64,19.35 J15.2 | MIC4R.CLK 81.33,6.82 arc90 v81,6.49 | v25.4,39.29 25.4,37.79 27.17,36.02 | 42.8,31.49 v42.8,32.09 v42.8,36.89 42.75,36.84 38.98,36.84 38.31,36.17 | 42.8,31.49 v42.8,29.39 v42.8,20.99 42.8,20.39 arc-90 41.9,19.49 40.39,19.49 arc90 J1.2 33.87,19.35 arc90 30.5,15.09 30.5,8.69 arc-90 28.4,6.59 v28.1,6.59 | v42.8,39.29 42.8,43.19 | 42.8,43.19 v42.8,44.99 v42.8,47.09 | v42.8,53.39 42.8,55.19 | MIC2L.CLK 10.67,46.16 arc90 v11,46.49 | v27,43.49 arc90 27.14,43.35 J5.2 42.64,43.35 arc-90 42.8,43.19 | v58.7,55.49 arc-90 58.57,55.35 J9.2 42.97,55.35 arc90 42.8,55.19 | 42.8,43.19 arc-90 42.97,43.35 J11.2 65.47,43.35 arc90 v65.6,43.49 | J13.2 56.25,29.34 arc-90 v56,29.09 | 38.17,36.02 38.31,36.17 | 38.17,36.02 27.17,36.02 | U$7.60 68.64,20.07 R9.1 R9.2 64.15,22.07 v63.74,22.47 | 27.17,36.02 27.13,36.02 | 38.17,36.02 arc90 38.31,36.17
  Bottom 0.3: v11,26.99 10.62,26.99 arc90 J4.2 arc90 10.39,26.49 v16,26.49 | v11,8.99 10.62,8.99 arc90 J2.2 16.87,8.62 arc-90 17.5,7.99 arc90 19,6.49 28,6.49 arc90 v28.1,6.59 | 10.62,63.99 v11,63.99 v18,63.99 | 10.62,63.99 arc90 J8.2 arc-90 10.62,63.99 | v81,24.99 81.39,24.99 arc90 J14.2 arc90 81.62,25.49 73.5,25.49 arc90 72.5,26.49 66.3,26.49 arc90 66.2,26.39 | 81.39,43.99 v81,43.99 74.5,43.99 arc-90 74,44.49 66.5,44.49 arc90 65.6,43.59 v65.6,43.49 | 81.39,43.99 arc90 J12.2 arc-90 81.39,43.99 | v27,43.49 arc90 26,44.49 19,44.49 arc-90 18.5,44.99 arc90 18,45.49 10.39,45.49 arc-90 J6.2 arc90 11,46.37 v11,46.49 | v24.5,61.99 24.5,62.49 arc90 v23,63.99 | v65.39,61.49 60.5,61.49 arc90 58.7,59.69 v58.7,55.49 | v74.5,61.99 81.5,61.99 arc-90 MIC3L.CLK | MIC3L.CLK 81.67,62.27 arc-90 J10.2 | MIC3L.CLK 81.33,61.82 arc90 v81,61.49 | v66,9.99 arc90 67,8.99 72.5,8.99 arc-90 73.5,7.99 arc90 74.5,6.99 81.5,6.99 arc-90 MIC4R.CLK 81.67,7.27 arc-90 J16.2 arc90 81,6.6 v81,6.49 | U$7.30 20.59,40.5 21.8,39.29 v25.4,39.29 | v42.8,36.89 v42.8,39.29 | v42.8,47.09 v42.8,53.39 | 43.1,45.29 arc90 v42.8,44.99 | 66.2,26.39 66.2,23.58 arc-90 65.09,22.47 v63.74,22.47 | 66.2,26.39 66.2,27.59 arc90 64.7,29.09 v56,29.09 43.1,29.09 arc-90 v42.8,29.39 | v60.5,18.49 60.5,18.59 arc90 59.6,19.49 44.3,19.49 arc-90 v42.8,20.99 | 68.41,20.28 U$7.60
VCC  (via drill 0.4, 0.5)
  Top 0.3: v5.5,29.49 arc90 5,28.99 C2.1 6.3,27.89 arc-90 MIC1R.VDD | v15.5,28.99 26.5,28.99 arc90 28.5,30.99 arc-90 31.75,34.24 35.65,34.24 arc90 v36.5,35.09 | MIC1L.SEL 8.68,7.17 arc-90 9.5,7.99 11,7.99 arc-90 11.5,7.49 arc90 12,6.99 R1.1 R1.2 13,9.49 arc90 12,10.49 8,10.49 arc90 7.17,9.66 MIC1L.VDD arc90 6.3,9.89 C1.1 arc90 5.5,10.39 v5.5,10.99 | C3.1 5.5,46.89 | 5.5,46.89 6.3,46.89 arc-90 MIC2L.VDD 7.17,46.66 arc-90 8,47.49 12.5,47.49 arc-90 13,46.99 R3.2 R3.1 12,43.99 arc-90 11.5,44.49 arc90 11,44.99 9.5,44.99 arc90 8.68,44.17 MIC2L.SEL | v5,47.99 5,47.39 arc90 5.5,46.89 | MIC2R.VDD arc90 6.3,64.89 C4.1 5,65.49 arc-90 v5.5,65.99 | MIC4R.VDD arc90 85.7,6.09 C8.1 87,5.49 arc-90 v86.5,4.99 | MIC4L.SEL 83.32,26.81 arc-90 82.5,25.99 81,25.99 arc-90 80.5,26.49 arc90 80,26.99 R7.1 R7.2 79,23.99 arc90 80,22.99 v87,22.99 C7.1 85.7,24.09 arc-90 MIC4L.VDD | MIC3R.VDD arc90 85.7,43.09 C6.1 v87,41.99 | MIC3L.SEL 83.32,63.81 arc-90 82.5,62.99 81,62.99 arc-90 80.5,63.49 arc90 80,63.99 R5.1 R5.2 79,60.99 arc90 80,59.99 v86.5,59.99 86.5,60.59 arc-90 C5.1 arc90 86.13,61.96 MIC3L.VDD | v17.5,9.99 arc90 18.5,8.99 24.5,8.99 arc90 26.5,10.99 26.5,13.99 arc-90 v26.6,14.09 | v18,65.49 arc-90 18.5,65.99 33.5,65.99 arc-90 36.1,63.39 36.1,62.79 arc90 v37.4,61.49 | v73.5,60.49 arc-90 72.5,59.49 67.59,59.49 arc90 66.08,58.27 66.08,54.96 arc-90 63.48,52.13 v47.6,52.19 | 73.75,41.74 arc90 v74.5,42.49 arc-90 73.7,41.69 52.15,41.69 arc-90 J11.1 47.7,42.08 arc90 v47.6,41.99 | v74.5,23.99 62,23.99 arc-90 60,25.99 arc90 59,26.99 v51.8,26.99 arc-90 51.75,27.04 J13.1
  Top 0.3: U$7.49 71.91,7.58 arc-90 v74,5.49 | J1.1 37.31,18.08 arc-90 v38.6,16.79 | J3.1 37.01,30.08 arc-90 v38.9,28.19 | J5.1 37.61,42.08 arc-90 v38.3,41.39 | J7.1 35.75,52.94 arc90 36.5,52.19 v47.6,52.19 | v47.61,57.89 arc90 v47.6,57.89 | v36.8,47.09 17.6,47.09 arc90 v17.5,46.99 | J9.1 49.5,54.08 arc90 v47.6,52.19 | J15.1 47.81,18.08 arc-90 47.6,18.29
  Top 0.6: v47.6,44.39 v47.6,48.29 | v47.6,33.89 v47.6,26.99 v47.6,21.89 47.6,18.29 v47.6,17.39
  Bottom 0.3: v5.5,29.49 5.5,28.14 arc90 J4.1 14.41,27.89 arc90 v15.5,28.99 | v5,47.99 arc-90 5.75,47.24 J6.1 arc-90 6.55,47.69 17,47.69 arc-90 17.41,47.28 17.41,46.89 arc90 v17.5,46.99 | v5.5,10.99 arc-90 5.75,10.74 J2.1 arc-90 5.85,9.99 v17.5,9.99 | v5.5,65.99 arc-90 5.75,65.74 J8.1 arc-90 6.35,65.49 v18,65.49 | v86.5,4.99 arc-90 86.25,5.24 J16.1 arc90 J16.1 85.7,6.09 arc-90 85.1,5.49 v74,5.49 | v87,22.99 arc-90 86.25,23.74 J14.1 74.6,24.08 arc90 v74.5,23.99 | v87,41.99 arc-90 86.25,42.74 J12.1 arc-90 85.66,42.49 v74.5,42.49 | J10.1 86.25,60.49 | 86.25,60.49 86.25,60.24 arc90 v86.5,59.99 | v73.5,60.49 86.25,60.49 | 68.76,7.49 71.82,7.49 arc90 71.91,7.58 U$7.49 | v47.6,17.39 arc-90 47,16.79 v38.6,16.79 29.3,16.79 arc90 v26.6,14.09 | v47.6,26.99 arc90 46.4,28.19 v38.9,28.19 arc-90 38,29.09 38,34.19 arc90 37.1,35.09 v36.5,35.09 | v47.6,44.39 arc-90 46.4,41.39 v38.3,41.39 arc-90 36.8,42.89 v36.8,47.09
  Bottom 0.6: U$7.49 U$7.50 | 68.76,7.49 64.7,7.49 arc-90 60.5,11.69 60.5,11.99 arc90 58.7,13.79 50.3,13.79 arc-90 47.6,16.49 v47.6,17.39 | v47.6,48.29 v47.6,52.19 v47.6,57.89 47.6,58.19 arc90 44.3,61.49 v37.4,61.49 | v47.6,44.39 v47.6,41.99 v47.6,33.89 | v51.8,26.99 v47.6,26.99
VDD_5V
  Top 0.6: U$7.52 U$7.51

### Text on the board
tPlace: (12,63) | SEL:GND | SEL:VCC | (88,63) | (12,45) | SEL:VCC | SEL:GND | (88,45) | (12,26) | SEL:GND | SEL:VCC | (88,26) | Tokyo Japan Nov 2017 | (12,8) | Designed by Robin Scheibler | SEL:VCC | v1.0 | KURODAKO | SEL:GND | (88,8)
tNames: MIC5 | MIC4 | MIC4 | MIC5 | MIC6 | MIC3 | MIC3 | MIC6 | MIC7 | MIC2 | MIC7 | MIC2 | PDM_CLK | MIC1 | MIC8 | P9.14 | MIC8 | MIC1
bNames: MIC4 | MIC5 | MIC3 | MIC6 | MIC2 | MIC7 | MIC1 | MIC8